# Altium schematic sheet USB_Hub.SchDoc
size A3; SheetNumber: 8; SheetTotal: 10
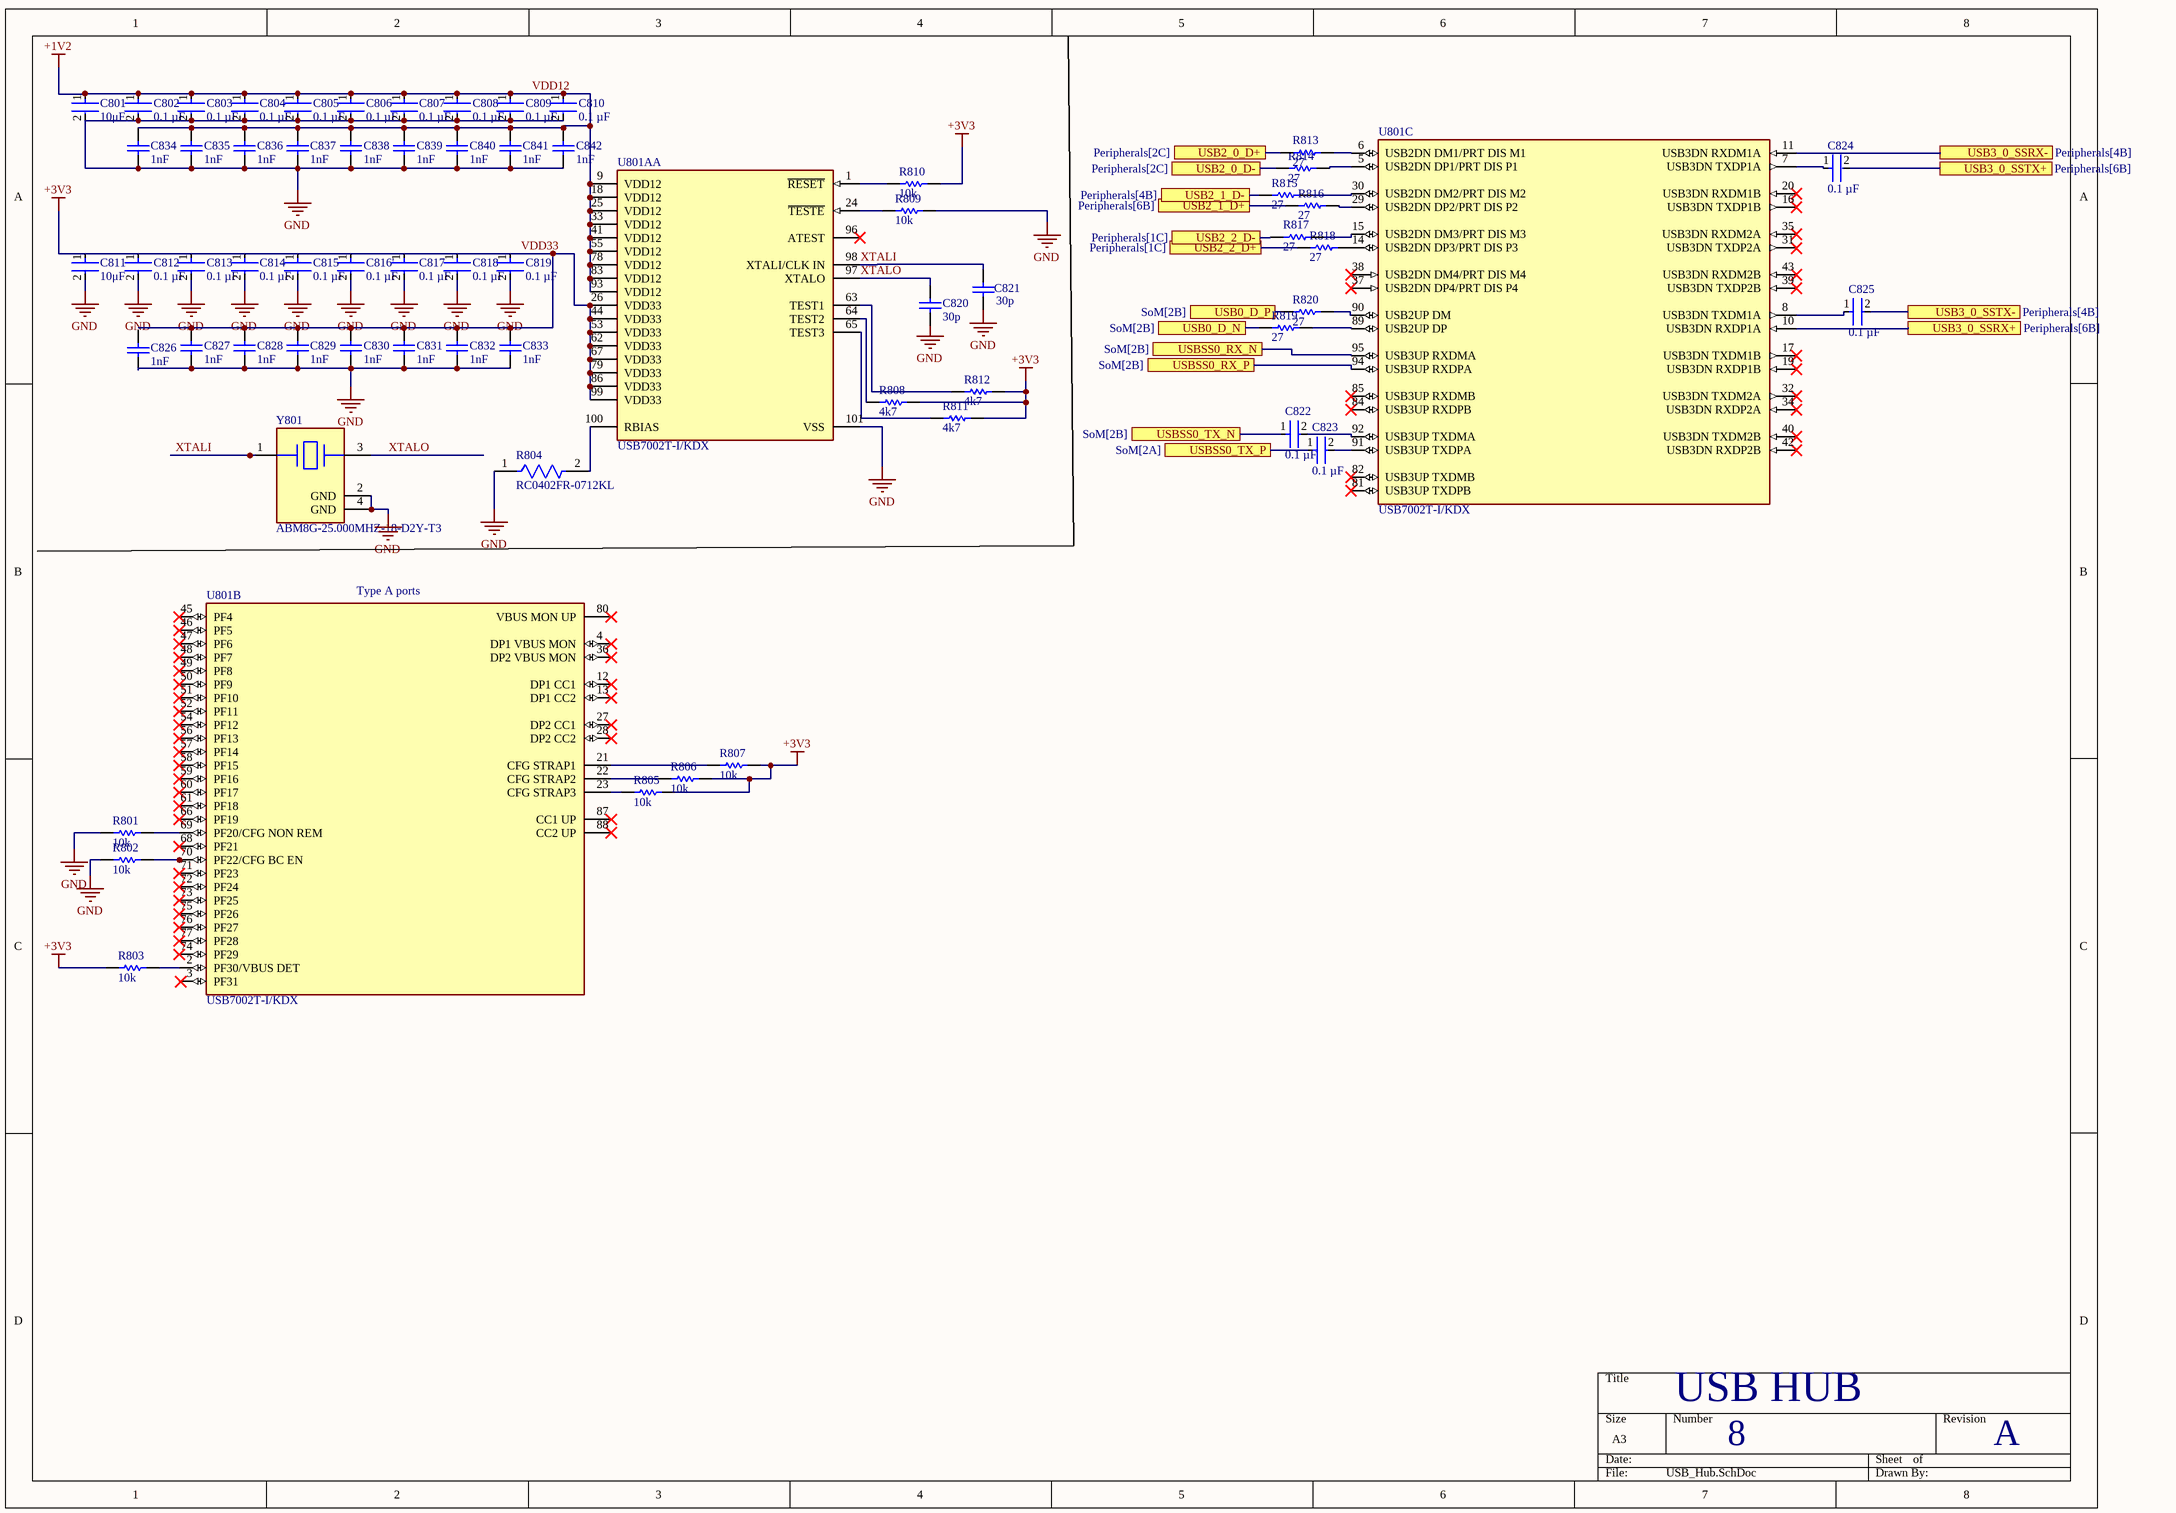
[diagram p0: USB_Hub.SchDoc]

## Parts
C801  10μF  [FP-GRM31C-0_2-e0_3_0_8-MFG]
C802  0.1 µF  [FP-GRM155-0_05-IPC_B]
C803  0.1 µF  [FP-GRM155-0_05-IPC_B]
C804  0.1 µF  [FP-GRM155-0_05-IPC_B]
C805  0.1 µF  [FP-GRM155-0_05-IPC_B]
C806  0.1 µF  [FP-GRM155-0_05-IPC_B]
C807  0.1 µF  [FP-GRM155-0_05-IPC_B]
C808  0.1 µF  [FP-GRM155-0_05-IPC_B]
C809  0.1 µF  [FP-GRM155-0_05-IPC_B]
C810  0.1 µF  [FP-GRM155-0_05-IPC_B]
C811  10μF  [FP-GRM31C-0_2-e0_3_0_8-MFG]
C812  0.1 µF  [FP-GRM155-0_05-IPC_B]
C813  0.1 µF  [FP-GRM155-0_05-IPC_B]
C814  0.1 µF  [FP-GRM155-0_05-IPC_B]
C815  0.1 µF  [FP-GRM155-0_05-IPC_B]
C816'  0.1 µF  [FP-GRM155-0_05-IPC_B]
C817  0.1 µF  [FP-GRM155-0_05-IPC_B]
C818  0.1 µF  [FP-GRM155-0_05-IPC_B]
C819  0.1 µF  [FP-GRM155-0_05-IPC_B]
C820  30p  [CAPC1005X55X25ML05T10]
C821  30p  [CAPC1005X55X25ML05T10]
C822  0.1 µF  [FP-GRM155-0_05-IPC_B]
C823  0.1 µF  [FP-GRM155-0_05-IPC_B]
C824  0.1 µF  [FP-GRM155-0_05-IPC_B]
C825  0.1 µF  [FP-GRM155-0_05-IPC_B]
C826  1nF  [CAPC1005X55X25ML5T10]
C827  1nF  [CAPC1005X55X25ML5T10]
C828  1nF  [CAPC1005X55X25ML5T10]
C829  1nF  [CAPC1005X55X25ML5T10]
C830  1nF  [CAPC1005X55X25ML5T10]
C831  1nF  [CAPC1005X55X25ML5T10]
C832  1nF  [CAPC1005X55X25ML5T10]
C833  1nF  [CAPC1005X55X25ML5T10]
C834  1nF  [CAPC1005X55X25ML5T10]
C835  1nF  [CAPC1005X55X25ML5T10]
C836  1nF  [CAPC1005X55X25ML5T10]
C837  1nF  [CAPC1005X55X25ML5T10]
C838  1nF  [CAPC1005X55X25ML5T10]
C839  1nF  [CAPC1005X55X25ML5T10]
C840  1nF  [CAPC1005X55X25ML5T10]
C841  1nF  [CAPC1005X55X25ML5T10]
C842  1nF  [CAPC1005X55X25ML5T10]
R801  10k  [RESC1005X40X25LL05T10]
R802  10k  [RESC1005X40X25LL05T10]
R803  10k  [RESC1005X40X25LL05T10]
R804  RC0402FR-0712KL  [FP-RC0402-0_4-IPC_C]
R805  10k  [RESC1005X40X25LL05T10]
R806  10k  [RESC1005X40X25LL05T10]
R807  10k  [RESC1005X40X25LL05T10]
R808  4k7  [RESC1005X40X25NL05T10]
R809  10k  [RESC1005X40X25LL05T10]
R810  10k  [RESC1005X40X25LL05T10]
R811  4k7  [RESC1005X40X25NL05T10]
R812  4k7  [RESC1005X40X25NL05T10]
R813  27  [RESC1005X40X25LL05T10]
R814  27  [RESC1005X40X25LL05T10]
R815  27  [RESC1005X40X25LL05T10]
R816  27  [RESC1005X40X25LL05T10]
R817  27  [RESC1005X40X25LL05T10]
R818  27  [RESC1005X40X25LL05T10]
R819  27  [RESC1005X40X25LL05T10]
R820  27  [RESC1005X40X25LL05T10]
U801  USB7002T-I/KDX  [FP-C04-407-KD-IPC_A]  (parts B,C of 3)
U801A  USB7002T-I/KDX  [FP-C04-407-KD-IPC_A]  (part A of 3)
Y801  ABM8G-25.000MHZ-18-D2Y-T3  [FP-ABM8G-MFG]

## Ports
USB0_D_N (see SoM[2B]), USB0_D_P (see SoM[2B]), USB2_0_D+ (see Peripherals[2C]), USB2_0_D- (see Peripherals[2C]), USB2_1_D+ (see Peripherals[6B]), USB2_1_D- (see Peripherals[4B]), USB2_2_D+ (see Peripherals[1C]), USB2_2_D- (see Peripherals[1C]), USB3_0_SSRX+ (see Peripherals[6B]), USB3_0_SSRX- (see Peripherals[4B]), USB3_0_SSTX+ (see Peripherals[6B]), USB3_0_SSTX- (see Peripherals[4B]), USBSS0_RX_N (see SoM[2B]), USBSS0_RX_P (see SoM[2B]), USBSS0_TX_N (see SoM[2B]), USBSS0_TX_P (see SoM[2A])

## Nets
GND: C801.2 C802.2 C803.2 C804.2 C805.2 C806.2 C807.2 C808.2 C809.2 C810.2 C811.2 C812.2 C813.2 C814.2 C815.2 C816'.2 C817.2 C818.2 C819.2 C821.1 C826.1 C827.1 C828.1 C829.1 C830.1 C831.1 C832.1 C833.1 C834.1 C835.1 C836.1 C837.1 C838.1 C839.1 C840.1 C841.1 C842.1 R801.2 R802.2 R804.1 R809.1 U801A.101(VSS) Y801.2(GND) Y801.4(GND)
VDD12: C801.1 C802.1 C803.1 C804.1 C805.1 C806.1 C807.1 C808.1 C809.1 C810.1 C834.2 C835.2 C836.2 C837.2 C838.2 C839.2 C840.2 C841.2 C842.2 U801A.9(VDD12) U801A.18(VDD12) U801A.25(VDD12) U801A.33(VDD12) U801A.41(VDD12) U801A.55(VDD12) U801A.78(VDD12) U801A.83(VDD12) U801A.93(VDD12)  [also labelled +1V2]
VDD33: C811.1 C812.1 C813.1 C814.1 C815.1 C816'.1 C817.1 C818.1 C819.1 C827.2 C828.2 C829.2 C830.2 C831.2 C832.2 C833.2 R803.2 R805.1 R806.1 R807.1 R808.2 R810.1 R811.2 R812.2 U801A.26(VDD33) U801A.44(VDD33) U801A.53(VDD33) U801A.62(VDD33) U801A.67(VDD33) U801A.79(VDD33) U801A.86(VDD33) U801A.99(VDD33)  [also labelled +3V3]
USB0_D_N: R819.1 ; port USB0_D_N
USB0_D_P: R820.1 ; port USB0_D_P
USB2_0_D+: R813.1 ; port USB2_0_D+
USB2_0_D-: R814.1 ; port USB2_0_D-
USB2_1_D+: R816.1 ; port USB2_1_D+
USB2_1_D-: R815.1 ; port USB2_1_D-
USB2_2_D+: R818.1 ; port USB2_2_D+
USB2_2_D-: R817.1 ; port USB2_2_D-
USB3_0_SSRX+: U801.10(USB3DN_RXDP1A) ; port USB3_0_SSRX+
USB3_0_SSRX-: U801.11(USB3DN_RXDM1A) ; port USB3_0_SSRX-
USB3_0_SSTX+: C824.2 ; port USB3_0_SSTX+
USB3_0_SSTX-: C825.2 ; port USB3_0_SSTX-
USBSS0_RX_N: U801.95(USB3UP_RXDMA) ; port USBSS0_RX_N
USBSS0_RX_P: U801.94(USB3UP_RXDPA) ; port USBSS0_RX_P
USBSS0_TX_N: C822.1 ; port USBSS0_TX_N
USBSS0_TX_P: C823.1 ; port USBSS0_TX_P
XTALI: C821.2 U801A.98(XTALI/CLK_IN) Y801.1
XTALO: C820.2 U801A.97(XTALO) Y801.3
NetC822_2: C822.2 U801.92(USB3UP_TXDMA)
NetC823_2: C823.2 U801.91(USB3UP_TXDPA)
NetC824_1: C824.1 U801.7(USB3DN_TXDP1A)
NetC825_1: C825.1 U801.8(USB3DN_TXDM1A)
NetR801_1: R801.1 U801.69(PF20/CFG_NON_REM)
NetR802_1: R802.1 U801.70(PF22/CFG_BC_EN)
NetR803_1: R803.1 U801.2(PF30/VBUS_DET)
NetR804_2: R804.2 U801A.100(RBIAS)
NetR805_2: R805.2 U801.23(CFG_STRAP3)
NetR806_2: R806.2 U801.22(CFG_STRAP2)
NetR807_2: R807.2 U801.21(CFG_STRAP1)
NetR808_1: R808.1 U801A.64(TEST2)
NetR809_2: R809.2 U801A.24(~{TESTE})
NetR810_2: R810.2 U801A.1(~{RESET})
NetR811_1: R811.1 U801A.65(TEST3)
NetR812_1: R812.1 U801A.63(TEST1)
NetR813_2: R813.2 U801.6(USB2DN_DM1/PRT_DIS_M1)
NetR814_2: R814.2 U801.5(USB2DN_DP1/PRT_DIS_P1)
NetR815_2: R815.2 U801.30(USB2DN_DM2/PRT_DIS_M2)
NetR816_2: R816.2 U801.29(USB2DN_DP2/PRT_DIS_P2)
NetR817_2: R817.2 U801.15(USB2DN_DM3/PRT_DIS_M3)
NetR818_2: R818.2 U801.14(USB2DN_DP3/PRT_DIS_P3)
NetR819_2: R819.2 U801.89(USB2UP_DP)
NetR820_2: R820.2 U801.90(USB2UP_DM)

Not connected (* = marked no-connect by the designer): C820 1; C826 2; U801 3(PF31) 4(DP1_VBUS_MON)* 12(DP1_CC1)* 13(DP1_CC2)* 16(USB3DN_TXDP1B)* 17(USB3DN_TXDM1B)* 19(USB3DN_RXDP1B)* 20(USB3DN_RXDM1B)* 27(DP2_CC1)* 28(DP2_CC2)* 31(USB3DN_TXDP2A)* 32(USB3DN_TXDM2A)* 34(USB3DN_RXDP2A)* 35(USB3DN_RXDM2A)* 36(DP2_VBUS_MON)* 37(USB2DN_DP4/PRT_DIS_P4)* 38(USB2DN_DM4/PRT_DIS_M4)* 39(USB3DN_TXDP2B)* 40(USB3DN_TXDM2B)* 42(USB3DN_RXDP2B)* 43(USB3DN_RXDM2B)* 45(PF4)* 46(PF5)* 47(PF6)* 48(PF7)* 49(PF8)* 50(PF9)* 51(PF10)* 52(PF11)* 54(PF12)* 56(PF13)* 57(PF14)* 58(PF15)* 59(PF16)* 60(PF17)* 61(PF18)* 66(PF19)* 68(PF21)* 71(PF23)* 72(PF24)* 73(PF25)* 74(PF29)* 75(PF26)* 76(PF27)* 77(PF28)* 80(VBUS_MON_UP)* 81(USB3UP_TXDPB)* 82(USB3UP_TXDMB)* 84(USB3UP_RXDPB)* 85(USB3UP_RXDMB)* 87(CC1_UP)* 88(CC2_UP)*; U801A 96(ATEST)*

## Notes on the sheet
- (near U801) Type A ports
- USB HUB
- 8
- A
- Labels drawn without touching a wire or pin: GND

## Library data of the parts
C801 C811 = CMP-06035-005515-1: Chip Multilayer Ceramic Capacitors for General Purpose, 1206, 10uF, X7R, 15%, 10%, 25V; Dielectric: X7R; Max Operating Temperature: 125°C; Capacitance: 10uF; Voltage Rating (DC): 25V; Case/Package: 1206; Thickness: 0.071inch; Tolerance: 10%; Voltage Rating: 25V; Mount: Surface Mount; Width: 0.063inch; Length: 0.126inch; Min Operating Temperature: -55°C; Packaging: Tape and Reel; Lead Free: Lead Free; Voltage: 25V
C802-C810 C812-C815 C816' C817-C819 C822-C825 = CMP-06035-003750-1: Chip Multilayer Ceramic Capacitors for General Purpose, 0402, 0.10uF, X7R, 15%, 10%, 50V; Capacitance: 100nF; Weight: 0.000212oz; Package Quantity: 50000; Resistor Type: Ceramic; Mount: Surface Mount; Width: 0.5mm; Case Code (Imperial): 0402; Termination: SMD/SMT; Case/Package: 0402; Voltage Rating: 50V; Height: 0.5mm; Length: 0.039inch; Dielectric: X7R; Case Code (Metric): 1005; Min Operating Temperature: -55°C; Thickness: 0.022inch; Tolerance: 10%; Lead Free: Lead Free; Packaging: Tape and Reel; Max Operating Temperature: 125°C; Voltage Rating (DC): 50V
C820 C821 = CMP-2008-04333-1: Part Number: GRM1555C1H300JA01D; Manufacturer: Murata
C826-C842 = CMP-1662-00017-1: Chip Capacitor, 1 nF, +/- 10%, 50 V, -55 to 125 degC, 0402 (1005 Metric), RoHS, Tape and Reel; Case\/Package: 0402; Type (Capacitors): X7R; Voltage Rating (DC): 50 V; Width: 0.5 mm; Pins: 2; REACH SVHC: No SVHC; Length: 1 mm; Height: 0.5 mm; PackageDescription: 2-Pin Surface Mount Device, Body 1 x 0.5 mm; DatasheetVersion: 07/2016; Mount: Surface Mount; ComponentLink2Description: Datasheet; Tolerance: 10%; ComponentLink2URL: http://psearch.en.murata.com/capacitor/product/GRM155R71H102KA01%23.pdf; ComponentLink1URL: http://www.murata.com/; Case Code (Metric): 1005; Package Quantity: 10000; Min Operating Temperature: -55 degC; Max Operating Temperature: 125 degC; Capacitance: 1 nF; Voltage Rating: 50 V; ComponentLink1Description: Manufacturer URL; Packaging: Tape and Reel; Radiation Hardening: No; RoHSCompliant: true; PackageReference: 0402; Mounting Technology: Surface Mount; Case Code (Imperial): 0402
R801-R803 R805-R807 R809 R810 = CMP-2002-07353-1: Part Number: RC0402FR-0710KL; Manufacturer: Yageo / Phycomp
R804 = CMP-2002-07378-2: RES SMD 12K OHM 1% 1/16W 0402; Power Rating: 62.5mW; Voltage Rating: 50V; Resistance: 12kR; Max Power Dissipation: 63mW; Temperature Coefficient: 100ppm/°C; Construction: Rectangular; Case Code (Metric): 1005; Package Quantity: 1; Weight: 2.3E-05oz; RoHS Compliant: Yes; Packaging: Tape and Reel; Case Code (Imperial): 0402; Military Standard: Not; Min Operating Temperature: -55°C; Depth: 0.5mm; Length: 1mm; Width: 0.02inch; Termination: SMD/SMT; Lead Free: Lead Free; Tolerance: 1%; REACH SVHC: No SVHC; Size Code: 0402; Resistance Tolerance: 1%; Series: RC; Max Operating Temperature: 155°C; Height: 0.016inch; Features: Moisture Resistant; Number of Terminations: 2; Case/Package: 0402; Resistor Type: Thick Film
R808 R811 R812 = CMP-1011-00586-2: Manufacturer: Yageo / Phycomp; Part Number: RC0402FR-074K7L
R813-R820 = CMP-2002-07055-1: Part Number: RC0402FR-0727RL; Manufacturer: Yageo / Phycomp
U801 U801A = CMP-06284-000086-1: IC USB 3.1 GEN 1 4 PORT 100VQFN; Case/Package: VQFN; RoHS Compliant: Yes; Interface: USB; Packaging: Tape and Reel
Y801 = CMP-27762-015132-1: Crystal 25MHz ±20ppm (Tol) ±30ppm (Stability) 18pF FUND 60Ω 4-Pin SMD T/R; ESR (Equivalent Series Resistance): 60R; Termination: SMD/SMT; Series: ABM8G; Max Operating Temperature: 85°C; Width: 2.5mm; Radiation Hardening: No; Mount: Surface Mount; Package Quantity: 3000; Frequency Stability: 30ppm; Min Operating Temperature: -40°C; Packaging: Tape and Reel; Number of Pins: 4; Frequency: 25MHz; Height: 0.039inch; Tolerance: 20ppm; Length: 3.2mm; Frequency Tolerance: 20ppm; Series Resistance: 60R; Depth: 2.5mm; Case/Package: SMD/SMT; Load Capacitance: 18pF